# Altium schematic sheet Sheet2.SchDoc
size A
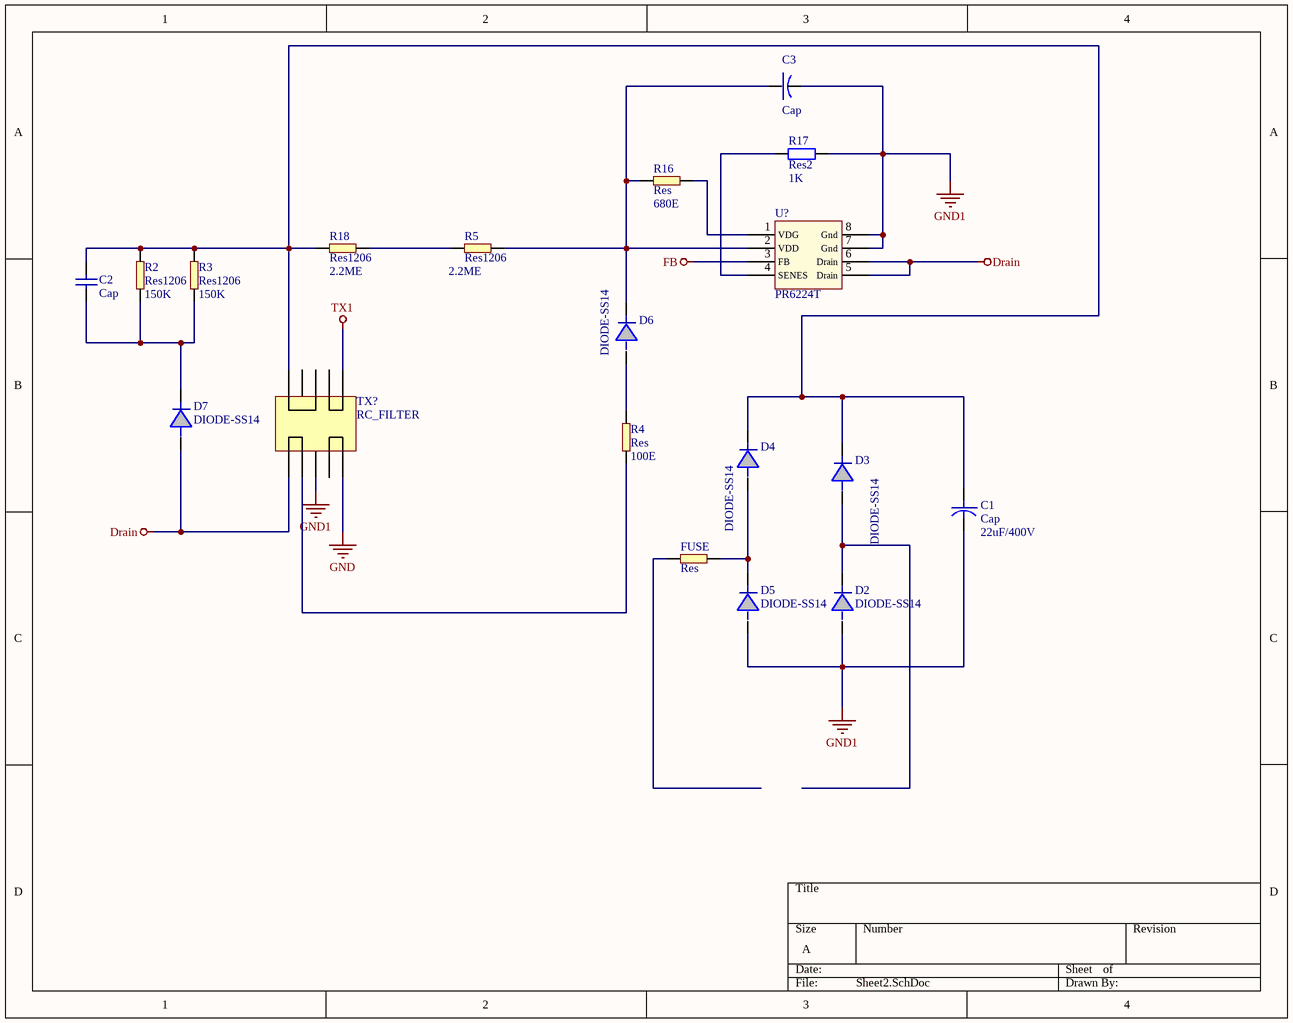
[diagram p0: Sheet2.SchDoc]

## Parts
C1  Cap  [CAP_470uF]
C2  Cap  [CAP_P]
C3  Cap  [Capacitor10UF/63V]
D2  DIODE-SS14  [DO-214AC]
D3  DIODE-SS14  [DO-214AC]
D4  DIODE-SS14  [DO-214AC]
D5  DIODE-SS14  [DO-214AC]
D6  DIODE-SS14  [DO-214AC]
D7  DIODE-SS14  [DO-214AC]
FUSE  Res  [Res_150mil]
R2  Res1206  value 150K  [1206]
R3  Res1206  value 150K  [1206]
R4  Res  value 100E  [RES0805]
R5  Res1206  value 2.2ME  [1206]
R16  Res  value 680E  [RES0805]
R17  Res2  value 1K  [AXIAL-0.4]
R18  Res1206  value 2.2ME  [1206]
TX?  RC_FILTER  [RC_FILTER]
U?  PR6224T  [PR6224T]

## Nets
Drain: D7.1(A) TX?.6 U?.5(Drain) U?.6(Drain)
FB: U?.3(FB)
GND: TX?.10
GND1: C1.2(b) C3.2(b) D2.1(A) D5.1(A) R17.2 TX?.8 U?.7(Gnd) U?.8(Gnd)
TX1: TX?.1
NetC1_1: C1.1(A) C2.2(A) D3.2(B) D4.2(B) R2.2(b) R3.2(b) R18.2(b) TX?.5
NetC2_1: C2.1(A) D7.2(B) R2.1(a) R3.1(a)
NetC3_1: C3.1(a) D6.2(B) R5.2(b) R16.1(a) U?.2(VDD)
NetD2_2: D2.2(B) D3.1(A)
NetD4_1: D4.1(A) D5.2(B) FUSE.1(a)
NetD6_1: D6.1(A) R4.2(b)
NetR4_1: R4.1(a) TX?.7
NetR5_1: R5.1(a) R18.1(a)
NetR16_2: R16.2(b) U?.1(VDG)
NetR17_1: R17.1 U?.4(SENES)

Not connected (* = marked no-connect by the designer): FUSE 2(b); TX? 2 3 4 9

## Notes on the sheet
- (in symbol CAP_470uF) 22uF/400V

## Library data of the parts
C1 = CAP_470uF
C2 = Capacitor
C3 = Cap-10uf/63V: Cap10uf/63V
D2-D7 = DIODE-SS14: SS14
FUSE = Res vertical placement
R4 R16 = Resistor: Res0805
R17 = Res2: Resistor; Published: 8-Jun-2000; LatestRevisionDate: 17-Jul-2002; LatestRevisionNote: Re-released for DXP Platform.; PackageReference: AXIAL-0.4; Publisher: Altium Limited; PackageDescription: Axial Device, Thru-Hole; 2 Leads; 0.4 in Pin Spacing
U? = PR6224T: MOSFET